# EAGLE design atmega16u2custom2 (EAGLE 7.1.0)
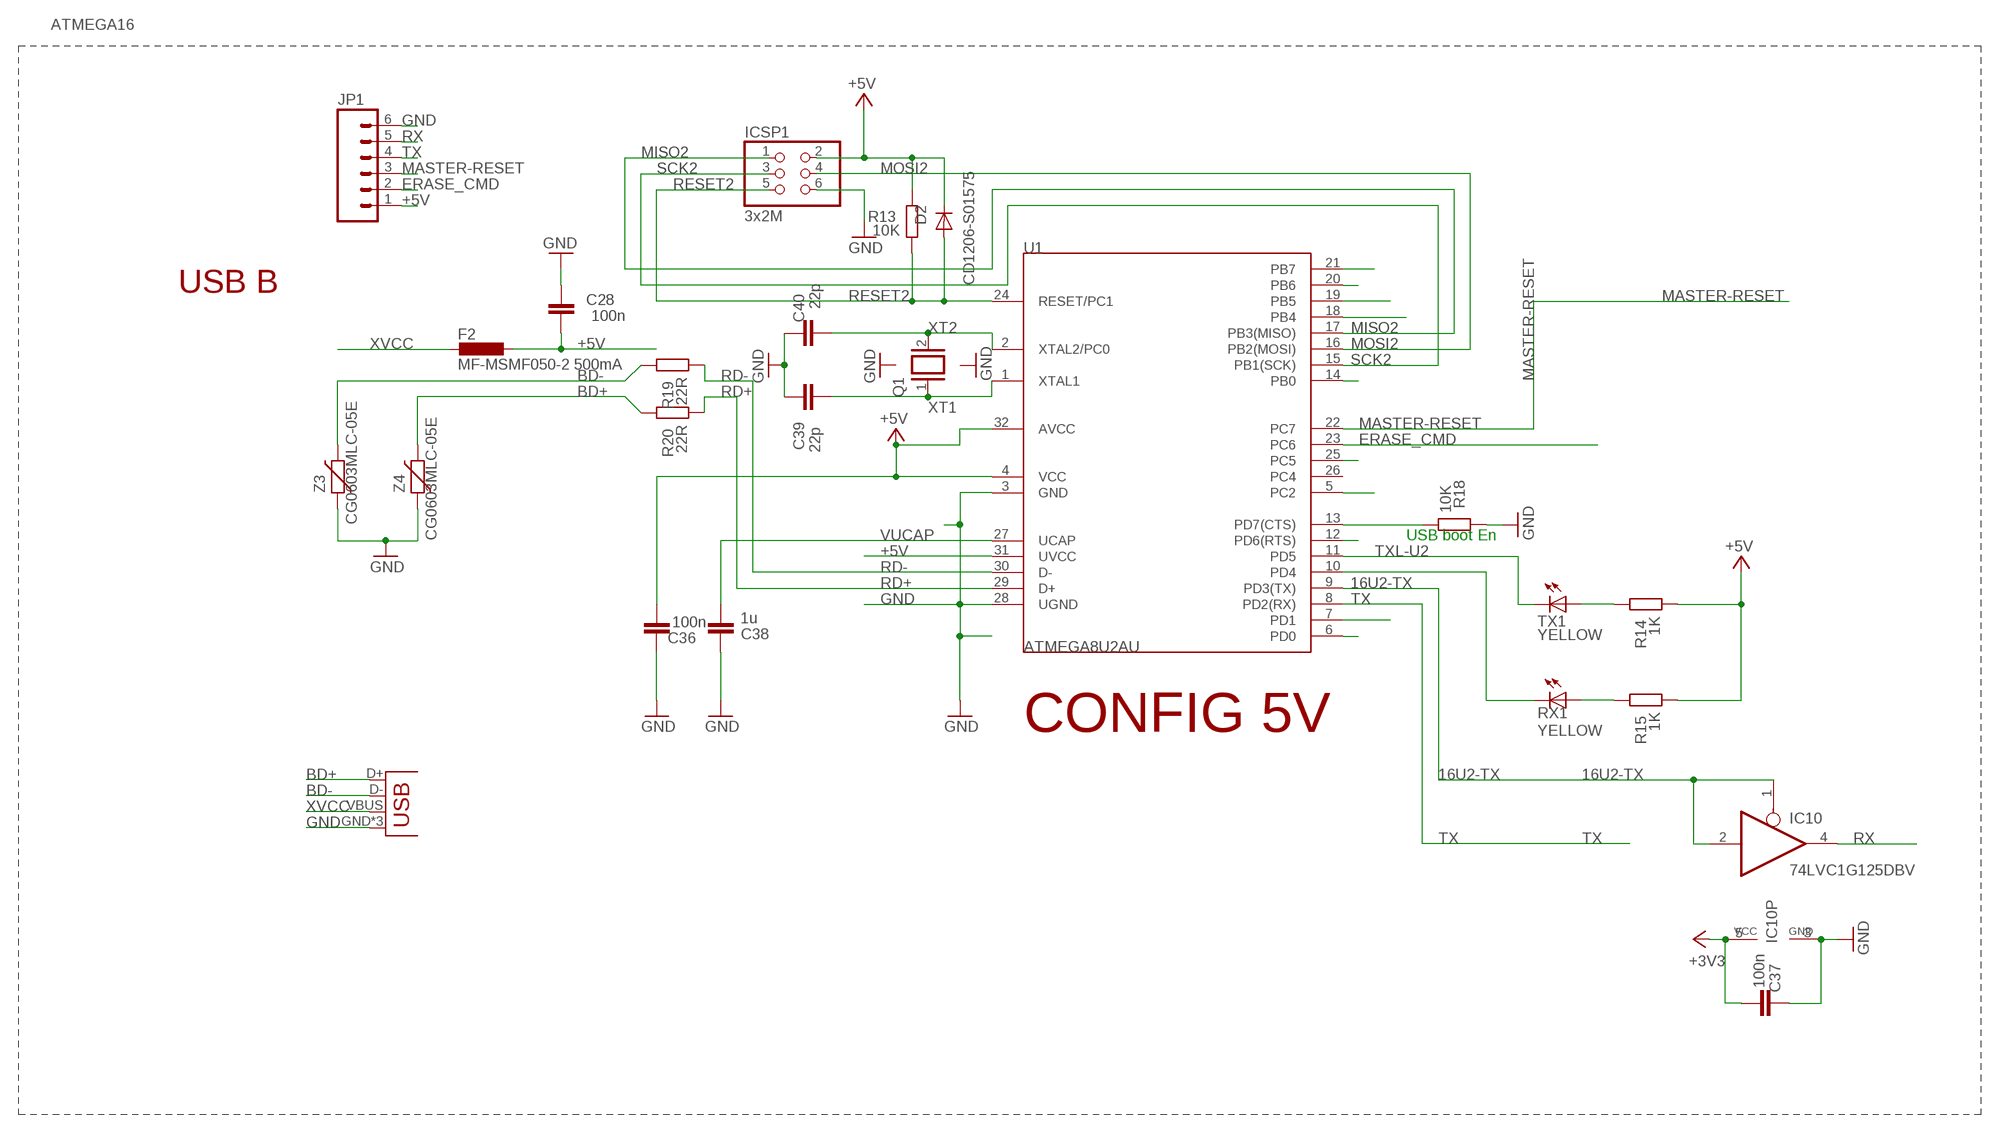
[diagram p0: schematic, sheet 1]

## Parts
C28  100n  C-EUC0805  [C0805]
C36  100n  C-EUC0805  [C0805]
C37  100n  C-EUC0805  [C0805]
C38  1u  C-EUC0805  [C0805]
C39  22p  C-EUC0805  [C0805]
C40  22p  C-EUC0805  [C0805]
D2  CD1206-S01575  DIODE-MINIMELF  [MINIMELF]
F2  MF-MSMF050-2 500mA  L-EUL1812  [L1812]
IC10  74LVC1G125DBV  [SOT23-5]
ICSP1  3x2M  PINHD-2X3  [2X03]
JP1  M06NO_SILK  [1X06_NO_SILK]
JP2  USB-MICROB  [USB-MICROB]
Q1  XTAL/S  [QS]
R13  10K  R-EU_R0805  [R0805]
R14  1K  R-EU_R0805  [R0805]
R15  1K  R-EU_R0805  [R0805]
R18  10K  R-EU_R0805  [R0805]
R19  22R  R-EU_R0805  [R0805]
R20  22R  R-EU_R0805  [R0805]
RX1  YELLOW  LEDCHIP-LED0805  [CHIP-LED0805]
TX1  YELLOW  LEDCHIP-LED0805  [CHIP-LED0805]
U1  ATMEGA8U2AU  [TQFP32-08]
Z3  CG0603MLC-05E  VARISTORCN0603  [CT/CN0603]
Z4  CG0603MLC-05E  VARISTORCN0603  [CT/CN0603]

## Nets
8PB4: U1.18(PB4)
8PB5: U1.19(PB5)
8PB6: U1.20(PB6)
16U2-TX: IC10.1(OE) IC10.2(I) U1.9(PD3(TX))
+3V3: C37.1 IC10.5(VCC)
+5V: C28.1 C36.1 D2.C F2.1 ICSP1.2 JP1.1 R13.2 R14.1 R15.1 U1.4(VCC) U1.31(UVCC) U1.32(AVCC)
BD+ [USB]: JP2.D+ R20.2 Z4.2
BD- [USB]: JP2.D- R19.2 Z3.2
DTR: R18.1 U1.13(PD7(CTS))
ERASE_CMD: JP1.2 U1.23(PC6)
GND: C28.2 C36.2 C37.2 C38.2 C39.2 C40.2 IC10.3(GND) ICSP1.6 JP1.6 JP2.GND JP2.MT1(GND) JP2.MT2(GND) R18.2 U1.3(GND) U1.28(UGND) Z3.1 Z4.1
MASTER-RESET: JP1.3 U1.22(PC7)
MISO2: ICSP1.1 U1.17(PB3(MISO))
MOSI2: ICSP1.4 U1.16(PB2(MOSI))
N$2: U1.5(PC2)
N$3: U1.6(PD0)
N$4: R15.2 RX1.A
N$5: U1.7(PD1)
N$6: U1.12(PD6(RTS))
N$7: U1.25(PC5)
N$8: U1.14(PB0)
N$9: U1.21(PB7)
N$14: R14.2 TX1.A
RD+: R20.1 U1.29(D+)
RD-: R19.1 U1.30(D-)
RESET2: D2.A ICSP1.5 R13.1 U1.24(RESET/PC1)
RX: IC10.4(O) JP1.5
RXL-U2: RX1.C U1.10(PD4)
SCK2: ICSP1.3 U1.15(PB1(SCK))
TX: JP1.4 U1.8(PD2(RX))
TXL-U2: TX1.C U1.11(PD5)
VUCAP: C38.1 U1.27(UCAP)
XT1: C39.1 Q1.1 U1.1(XTAL1)
XT2: C40.1 Q1.2 U1.2(XTAL2/PC0)
XVCC [usbvcc]: F2.2 JP2.VBUS
Unconnected: U1.26(PC4)

## Notes on the sheet
- ATMEGA16
- USB B
- USB boot En
- CONFIG 5V

## Library data of the parts
C28 C36-C40 = SmartPrj:C-EU: CAPACITOR, European symbol
D2 = diode:DIODE-: DIODE
F2 = rcl:L-EU: INDUCTOR, European symbol
IC10 = 74xx-little-us:74*1G125: Single Bus Buffer Gate with 3-State Output
ICSP1 = SmartPrj:PINHD-2X3: PIN HEADER
JP1 = SparkFun-Connectors:M06: Header 6 Standard 6-pin 0.1" header. Use with straight break away headers (SKU : PRT-00116), right angle break away headers (PRT-00553), swiss pins (PRT-00743), machine pins (PRT-00117), and female headers (PRT-00115). Molex polarized connector foot print use with SKU : PRT-08094 with associated crimp pins and housings. NOTES ON THE VARIANTS LOCK and LOCK_LONGPADS... This footprint was designed to help hold the alignment of a through-hole component (i.e. 6-pin header) while soldering it into place. You may notice that each hole has been shifted either up or down by 0.005 of an inch from it's more standard position (which is a perfectly straight line). This slight alteration caused the pins (the squares in the middle) to touch the edges of the holes. Because they are alternating, it causes a "brace" to hold the component in place. 0.005 has proven to be the perfect amount of "off-center" position when using our standard breakaway headers. Although looks a little odd when you look at the bare footprint, once you have a header in there, the alteration is very hard to notice. Also,if you push a header all the way into place, it is covered up entirely on the bottom side. This idea of altering the position of holes to aid alignment will be further integrated into the Sparkfun Library for other footprints. It can help hold any component with 3 or more connection pins.
JP2 = SparkFun-Connectors:USB: USB Connectors USB-B-PTH is fully proven SKU : PRT-00139/CONN-08278 USB-miniB is fully proven SKU : PRT-00587 USB-A-PCB is untested. USB-A-H is throughly reviewed, but untested. Spark Fun Electronics SKU : PRT-00437 USB-B-SMT is throughly reviewed, but untested. Needs silkscreen touching up. USB-A-S has not been used/tested USB-MB-H has not been used/tested USB-MICROB has been used. CONN-09505; PROD_ID: CONN-09505
Q1 = special:XTAL/S: CRYSTAL
R13-R15 R18-R20 = SmartPrj:R-EU_: RESISTOR, European symbol
RX1 TX1 = led:LED: LED OSRAM: - CHIPLED LG R971, LG N971, LY N971, LG Q971, LY Q971, LO R971, LY R971 LH N974, LH R974 LS Q976, LO Q976, LY Q976 LO Q996 - Hyper CHIPLED LW Q18S LB Q993, LB Q99A, LB R99A - SideLED LS A670, LO A670, LY A670, LG A670, LP A670 LB A673, LV A673, LT A673, LW A673 LH A674 LY A675 LS A676, LA A676, LO A676, LY A676, LW A676 LS A679, LY A679, LG A679 - Hyper Micro SIDELED® LS Y876, LA Y876, LO Y876, LY Y876 LT Y87S - SmartLED LW L88C, LW L88S LB L89C, LB L89S, LG L890 LS L89K, LO L89K, LY L89K LS L896, LA L896, LO L896, LY L896 - TOPLED LS T670, LO T670, LY T670, LG T670, LP T670 LSG T670, LSP T670, LSY T670, LOP T670, LYG T670 LG T671, LOG T671, LSG T671 LB T673, LV T673, LT T673, LW T673 LH T674 LS T676, LA T676, LO T676, LY T676, LB T676, LH T676, LSB T676, LW T676 LB T67C, LV T67C, LT T67C, LS T67K, LO T67K, LY T67K, LW E67C LS E67B, LA E67B, LO E67B, LY E67B, LB E67C, LV E67C, LT E67C LW T67C LS T679, LY T679, LG T679 LS T770, LO T770, LY T770, LG T770, LP T770 LB T773, LV T773, LT T773, LW T773 LH T774 LS E675, LA E675, LY E675, LS T675 LS T776, LA T776, LO T776, LY T776, LB T776 LHGB T686 LT T68C, LB T68C - Hyper Mini TOPLED® LB M676 - Mini TOPLED Santana® LG M470 LS M47K, LO M47K, LY M47K Source: http://www.osram.convergy.de LUXEON: - LUMILED® LXK2-PW12-R00, LXK2-PW12-S00, LXK2-PW14-U00, LXK2-PW14-V00 LXK2-PM12-R00, LXK2-PM12-S00, LXK2-PM14-U00 LXK2-PE12-Q00, LXK2-PE12-R00, LXK2-PE12-S00, LXK2-PE14-T00, LXK2-PE14-U00 LXK2-PB12-K00, LXK2-PB12-L00, LXK2-PB12-M00, LXK2-PB14-N00, LXK2-PB14-P00, LXK2-PB14-Q00 LXK2-PR12-L00, LXK2-PR12-M00, LXK2-PR14-Q00, LXK2-PR14-R00 LXK2-PD12-Q00, LXK2-PD12-R00, LXK2-PD12-S00 LXK2-PH12-R00, LXK2-PH12-S00 LXK2-PL12-P00, LXK2-PL12-Q00, LXK2-PL12-R00 Source: www.luxeon.com KINGBRIGHT: KA-3528ASYC Source: www.kingbright.com
U1 = SparkFun-DigitalIC:ATMEGA8U2: Atmel 32-pin 8-bit Microcontroller with 8/16/32K Bystes of ISP Flash and USB Controller. ATmega8U2, ATmega16U2, and ATmega32U2
Z3 Z4 = varistor:VARISTOR: VARISTOR

## Net classes
0 default: width 0.203 mm, drill 0.406 mm, clearance 0.203 mm
1 USB: width 0.203 mm, drill 0.406 mm, clearance 0.203 mm
3 usbvcc: width 0.203 mm, drill 0.406 mm, clearance 0.203 mm

## Board
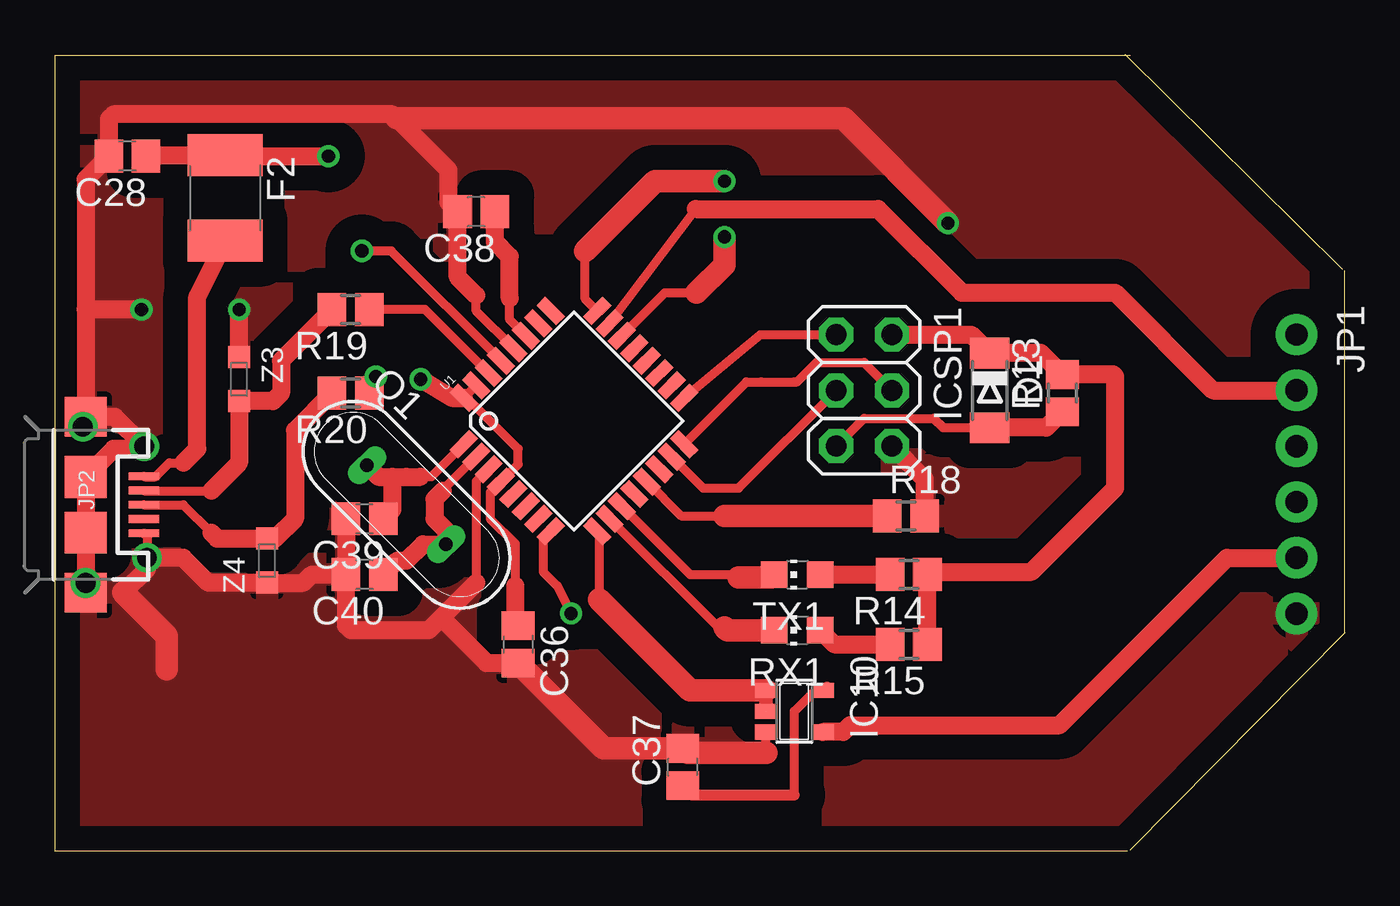
[diagram p1: board, top side]
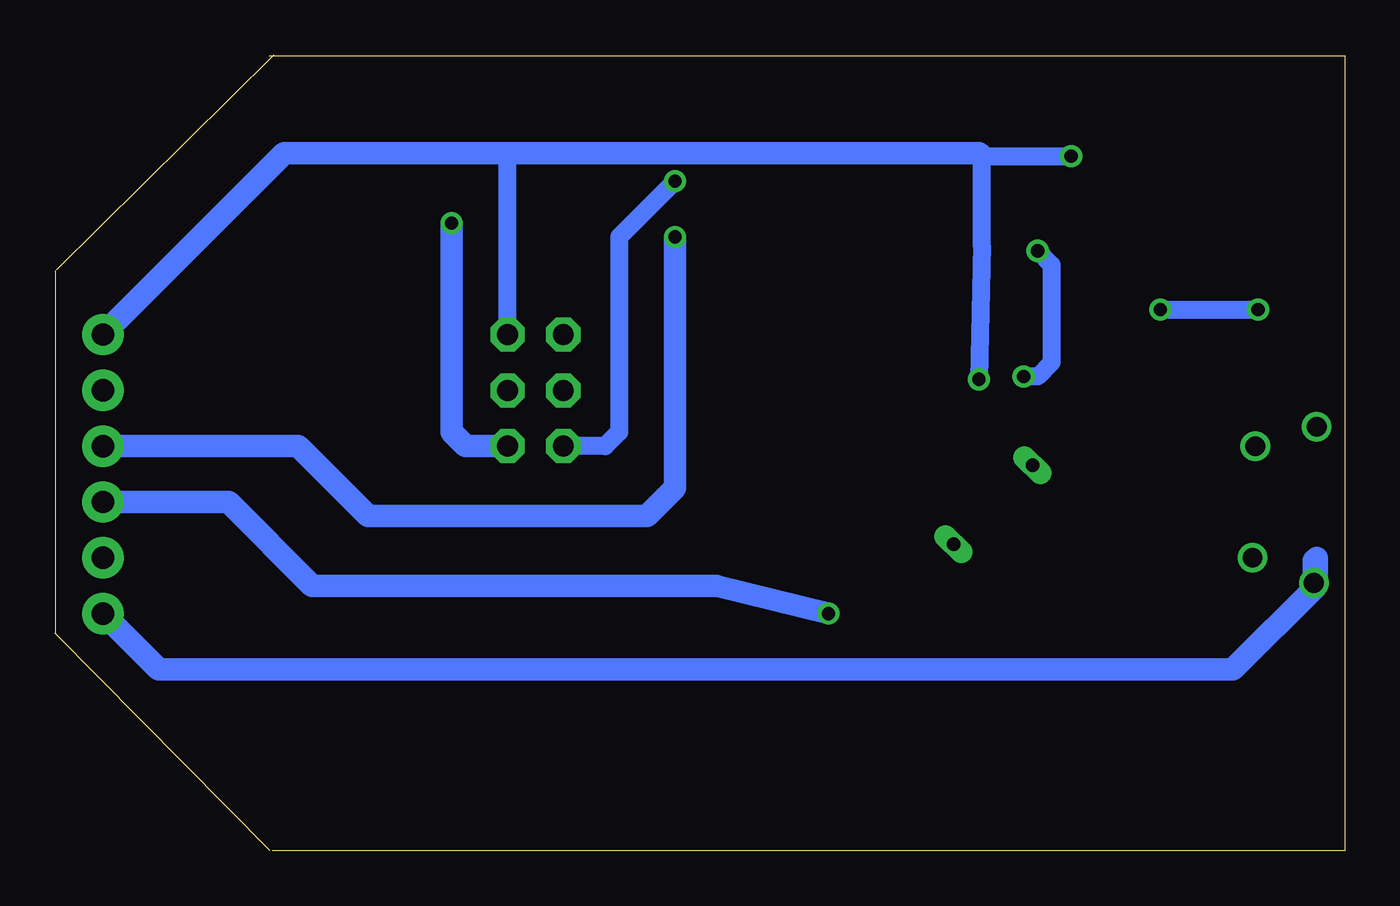
[diagram p2: board, bottom side, seen from below]

Size 58.7 x 36.23 mm. Coordinates in mm from the lower left corner, seen from the top.
Outline: 48.82,0 0,0 0,36.19 48.95,36.19
Outline: 58.7,9.91 48.92,0.01
Outline: 58.62,26.45 48.72,36.23
Outline: 58.67,26.41 58.67,9.91
Copper layers (1*16): Top 0.0178mm / dielectric 59mil / Bottom 0.0178mm
Design rules "epl-lpkf": minimum track width 8mil, minimum drill 0.35mm, track to track 8mil, track to pad 8mil, pad to pad 8mil, via to via 8mil, smd to smd 8mil, copper to edge 15mil, drill to drill 15mil, minimum pad ring 8mil, minimum via ring 8mil, stop-mask expansion 3mil, vias tented up to drill 0mil, thermal gap 10mil

### Footprints (pad centres in the part's own frame; a part is rotated, then mirrored left to right if it is on the bottom)
C0805 = smd 1.3 x 1.5: 1 -0.85,0; 2 0.85,0
MINIMELF = smd 1.4 x 1.8: A 1.7,0; C -1.7,0
L1812 = smd 1.9 x 3.4: 1 -1.95,0; 2 1.95,0
SOT23-5 = smd 0.69 x 0.99: 1 -0.95,-1.29; 2 0,-1.29; 3 0.95,-1.29; 4 0.95,1.3; 5 -0.95,1.3
2X03 = drill 0.95 pad 1.55 octagon: 1 -2.54,-1.27; 2 -2.54,1.27; 3 0,-1.27; 4 0,1.27; 5 2.54,-1.27; 6 2.54,1.27
1X06_NO_SILK = drill 1.016 pad 1.88: 1 0,0; 2 2.54,0; 3 5.08,0; 4 7.62,0; 5 10.16,0; 6 12.7,0
USB-MICROB = smd 0.35 x 1.4: D+ 0,2.65; D- -0.65,2.65; GND 1.3,2.65; ID 0.65,2.65; VBUS -1.3,2.65 | smd 1.8 x 1.9: MT1 -4,0; MT2 4,0 | smd 1.9 x 1.9: P$1 -1.27,0; P$2 1.27,0
QS = drill 0.61 long: 1 -2.54,0; 2 2.54,0
R0805 = smd 1.3 x 1.5: 1 -0.85,0; 2 0.85,0
CHIP-LED0805 = smd 1.2 x 1.2: A 0,-1.05; C 0,1.05
TQFP32-08 = smd 1.27 x 0.559: 1 -4.293,2.8; 2 -4.293,2; 3 -4.293,1.2; 4 -4.293,0.4; 5 -4.293,-0.4; 6 -4.293,-1.2; 7 -4.293,-2; 8 -4.293,-2.8; 17 4.293,-2.8; 18 4.293,-2; 19 4.293,-1.2; 20 4.293,-0.4; 21 4.293,0.4; 22 4.293,1.2; 23 4.293,2; 24 4.293,2.8 | smd 0.559 x 1.27: 9 -2.8,-4.293; 10 -2,-4.293; 11 -1.2,-4.293; 12 -0.4,-4.293; 13 0.4,-4.293; 14 1.2,-4.293; 15 2,-4.293; 16 2.8,-4.293; 25 2.8,4.293; 26 2,4.293; 27 1.2,4.293; 28 0.4,4.293; 29 -0.4,4.293; 30 -1.2,4.293; 31 -2,4.293; 32 -2.8,4.293
CT/CN0603 = smd 1 x 1: 1 -1,0; 2 1,0

### Placement (x,y rotation side)
C28  3.3,31.62 180 top
C36  21.08,9.4 270 top
C37  28.57,3.81 90 top
C38  19.18,29.08 180 top
C39  14.1,15.11 180 top
C40  14.1,12.57 180 top
D2  42.55,20.95 270 top
F2  7.75,29.72 270 top
IC10  33.66,6.35 270 top
ICSP1  36.83,20.95 270 top
JP1  56.52,23.5 270 top
JP2  1.4,15.75 270 top
Q1  16,15.75 315 top
R13  45.85,20.83 90 top
R14  38.86,12.57 180 top
R15  38.86,9.4 180 top
R18  38.73,15.24 0 top
R19  13.46,24.64 180 top
R20  13.46,20.83 180 top
RX1  33.78,10.03 90 top
TX1  33.78,12.57 90 top
U1  23.62,19.56 45 top
Z3  8.38,21.46 270 top
Z4  9.65,13.21 90 top

### Tracks (layer width: path | path; a pad name or v marks a point on that pad's centre or on a via)
16U2-TX
  Top 0.406: U1.9 24.77,14.45 24.77,11.43
  Top 0.61: 32.07,7.3 IC10.1 IC10.2
  Top 1.016: 24.77,11.43 28.89,7.3 IC10.1
+3V3
  Top 0.406: 35.14,7.48 IC10.5 34.6,7.3 33.66,6.35 33.66,2.54 | C37.1 29,2.54
  Top 0.508: 29,2.54 33.66,2.54
+5V  (via drill 0.6)
  Top 0.406: U1.31 U1.32 18.76,20.61 21.08,18.29 21.08,17.58 U1.4 19.81,16.31 19.81,15.11 20.95,13.97 20.95,12.07
  Top 0.813: C28.1 4.2,31.67 F2.1 7.79,31.62 v12.45,31.62 | R15.1 R14.1 39.84,12.7 44.45,12.7 48.26,16.51 48.26,21.59 48.17,21.68 R13.2 44.87,22.66 D2.C 41.7,23.5 ICSP1.2 | v16.64,21.46 18.07,20.61 U1.32 | C36.1 20.95,10.38 20.95,12.07
  Bottom 0.813: v16.64,21.46 16.51,27.56 16.51,31.62 v12.45,31.62 | ICSP1.2 38.1,31.75
  Bottom 1.016: JP1.1 48.26,31.75 38.1,31.75 16.64,31.75 16.51,31.62
BD+
  Top 0.406: JP2.D+ 5.84,15.75 7.11,14.48
  Top 0.813: Z4.2 9.67,14.22 | 7.11,14.48 7.38,14.21 Z4.2 | R20.2 10.92,19.14 10.92,15.11 10.02,14.21 Z4.2
BD-
  Top 0.406: JP2.D- 4.06,16.38 7.11,16.38
  Top 0.813: 7.11,16.38 8.38,17.65 Z3.2 9.92,20.46 10.29,20.83 10.29,22.31 R19.2
DTR
  Top 0.406: U1.13 28.51,15.24 30.48,15.24
  Top 1.016: 30.48,15.24 R18.1
ERASE_CMD
  Top 0.406: U1.23 29.18,29.21
  Top 0.813: 29.18,29.21 37.47,29.21 41.27,25.4 48.26,25.4 52.7,20.95 JP1.2
GND  (via drill 0.6, 0.9)
  Top 0.406: JP2.GND 4.19,14.3 v4.19,13.34 | U1.28 19.18,24.57 19.18,25.27 | U1.3 19.18,16.81 19.18,12.19 | 32.38,4.45 32.37,4.46 IC10.3
  Top 0.813: 3.11,11.75 4.19,12.83 v4.19,13.34 | v4.19,13.34 4.33,13.48 | 1.59,11.94 1.4,12.13 v1.4,12.19 1.4,17.02 2.67,18.29 3.94,18.29 v4.06,18.41 2.73,19.75 JP2.MT1 | v1.27,19.3 1.4,19.43 JP2.MT1 | 1.4,24.64 1.4,30.57 C28.2 2.45,33.31 2.67,33.53 15.37,33.53 15.56,33.34 17.91,30.99 17.91,29.5 C38.2 18.33,26.12 19.18,25.27 | 1.4,24.64 JP2.MT1 | C39.2 C40.2 | C40.2 11.68,12.57 11.3,12.19 9.67,12.19 Z4.1 9.64,12.19 6.99,12.19 5.84,13.34 v4.19,13.34 | C40.2 13.25,10.25 13.46,10.03 17.02,10.03 17.78,10.79 | Z3.1 v8.38,24.64 | v3.94,24.64 1.4,24.64 | 19.18,12.19 17.78,10.79 | 17.78,10.79 17.78,10.41 19.65,8.55 C36.2 | ICSP1.6 39.59,16.93 R18.2
  Top 1.016: 15.56,33.34 35.88,33.34 v40.64,28.58 | C36.2 24.97,4.66 C37.2 28.79,4.45 32.38,4.45 | JP2.MT2 v1.4,12.19 | 3.11,11.75 5.08,9.78 5.08,8.25
  Bottom 0.813: v8.38,24.64 v3.94,24.64
  Bottom 1.016: ICSP1.6 40.01,18.41 40.64,19.05 v40.64,28.58 | JP1.6 53.98,8.25 5.08,8.25 1.27,12.07 1.27,13.34 1.4,13.21 v1.4,12.19
  pour Top (isolate 1.143): 0,0 0,36.2 48.26,36.2 58.42,26.04 58.42,10.16 48.26,0 47.62,0
MASTER-RESET  (via drill 0.6)
  Top 0.406: U1.22 27.77,25.4 29.21,25.4
  Top 1.016: 29.21,25.4 30.48,26.67 v30.48,27.94
  Bottom 1.016: JP1.3 47.62,18.41 44.45,15.24 31.75,15.24 30.48,16.51 v30.48,27.94
MISO2
  Top 0.406: U1.17 32.11,23.5 ICSP1.1
MOSI2
  Top 0.406: ICSP1.4 36.83,22.23 34.67,22.23 33.78,21.34 33.66,21.34 32.15,21.34 31.47,21.34 U1.16
N$4
  Top 0.813: RX1.A 35.47,9.4 R15.2
N$14
  Top 0.813: TX1.A R14.2
RD+  (via drill 0.6)
  Top 0.406: U1.29 15.31,27.3 v13.97,27.3
  Top 0.813: v14.61,21.59 14.31,21.3 R20.1
  Bottom 0.813: v13.97,27.3 13.34,26.67 13.34,22.23 13.97,21.59 v14.61,21.59
RD-
  Top 0.406: U1.30 16.84,24.64 R19.1
RESET2  (via drill 0.6)
  Top 0.406: ICSP1.5 36.83,19.68 40.01,19.68 40.44,19.25 D2.A | 29.31,30.48 v30.48,30.48 | U1.24 24.13,25.12 24.13,27.3
  Top 0.813: R13.1 45.12,19.25 D2.A
  Top 1.016: 24.13,27.3 27.3,30.48 v30.48,30.48
  Bottom 0.813: v30.48,30.48 33.02,27.94 33.02,19.05 33.66,18.41 ICSP1.5
RX
  Top 0.813: IC10.4 35.88,5.4 36.2,5.71 45.72,5.71 53.34,13.34 JP1.5
RXL-U2
  Top 0.406: U1.10 30.19,10.16 30.48,10.16
  Top 1.016: 30.48,10.16 30.61,10.03 RX1.C
SCK2
  Top 0.406: U1.15 29.5,16.51 31.11,16.51 ICSP1.3
TX  (via drill 0.6)
  Top 0.406: U1.8 22.23,14.2 22.23,12.7 22.86,12.07 v23.5,10.79
  Bottom 1.016: v23.5,10.79 28.57,12.07 46.99,12.07 50.8,15.88 JP1.4
TXL-U2
  Top 0.406: 31.11,12.45 30.99,12.57 28.91,12.57 U1.11
  Top 1.016: TX1.C 32.6,12.45 31.11,12.45
VUCAP
  Top 0.406: U1.27 20.7,24.18 20.7,25.15
  Top 0.813: 20.7,25.15 20.7,27.05 20.03,27.73 C38.1
XT1
  Top 0.406: U1.1 17.12,17.02 16,17.02
  Top 0.813: Q1.1 14.73,17.02 15.37,17.02 | 15.37,17.02 16,17.02 16.64,17.02 | C39.1 15.37,15.53 15.37,17.02
XT2
  Top 0.406: U1.2 17.65,16.42 17.65,16.38
  Top 0.813: 17.65,16.38 17.27,16 17.27,15.11 17.8,14.59 Q1.2 16.75,13.95 16,13.21 15.58,13.21 C40.1
XVCC
  Top 0.406: 5.84,17.65 5.21,17.65 4.57,17.02 4.08,17.02 JP2.VBUS
  Top 0.813: F2.2 6.48,25.23 6.48,18.29 5.84,17.65